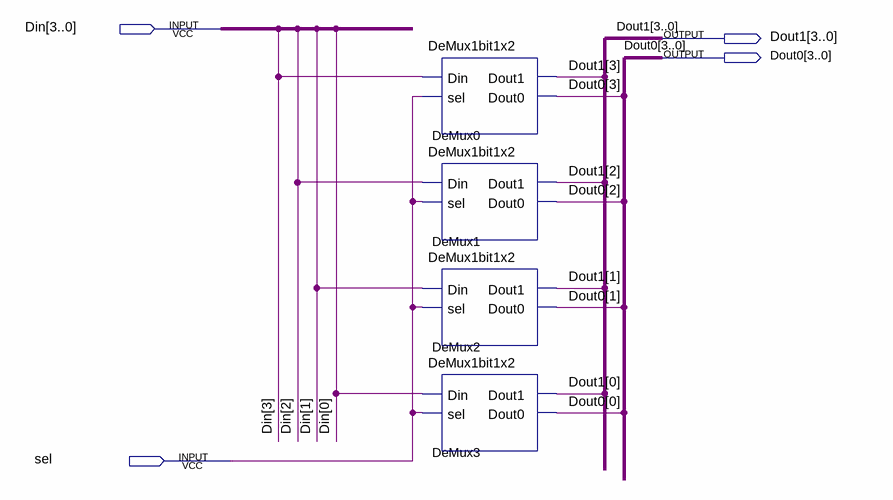
[diagram p0: schematic sheet]
// Quartus schematic DeMux4bit1x2.bdf as structural Verilog: 4 symbols, 4 pins
module DeMux4bit1x2 (
  input  [3:0] Din,
  input  sel,
  output [3:0] Dout1,
  output [3:0] Dout0
);

  DeMux1bit1x2 DeMux0 (.Din(Din[3]), .sel(sel), .Dout1(Dout1[3]), .Dout0(Dout0[3]));
  DeMux1bit1x2 DeMux1 (.Din(Din[2]), .sel(sel), .Dout1(Dout1[2]), .Dout0(Dout0[2]));
  DeMux1bit1x2 DeMux2 (.Din(Din[1]), .sel(sel), .Dout1(Dout1[1]), .Dout0(Dout0[1]));
  DeMux1bit1x2 DeMux3 (.Din(Din[0]), .sel(sel), .Dout1(Dout1[0]), .Dout0(Dout0[0]));
endmodule
